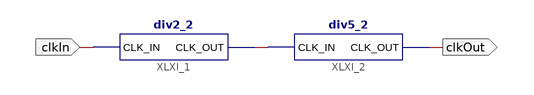
[diagram p0: schematic sheet 1]
// Xilinx ISE schematic div10_2.sch (spartan6) as structural Verilog: 2 symbols, 2 ports
module div10_2 (
  input  clkIn,
  output clkOut
);

  wire XLXN_1;

  div2_2 XLXI_1 (.CLK_IN(clkIn), .CLK_OUT(XLXN_1));
  div5_2 XLXI_2 (.CLK_IN(XLXN_1), .CLK_OUT(clkOut));
endmodule
